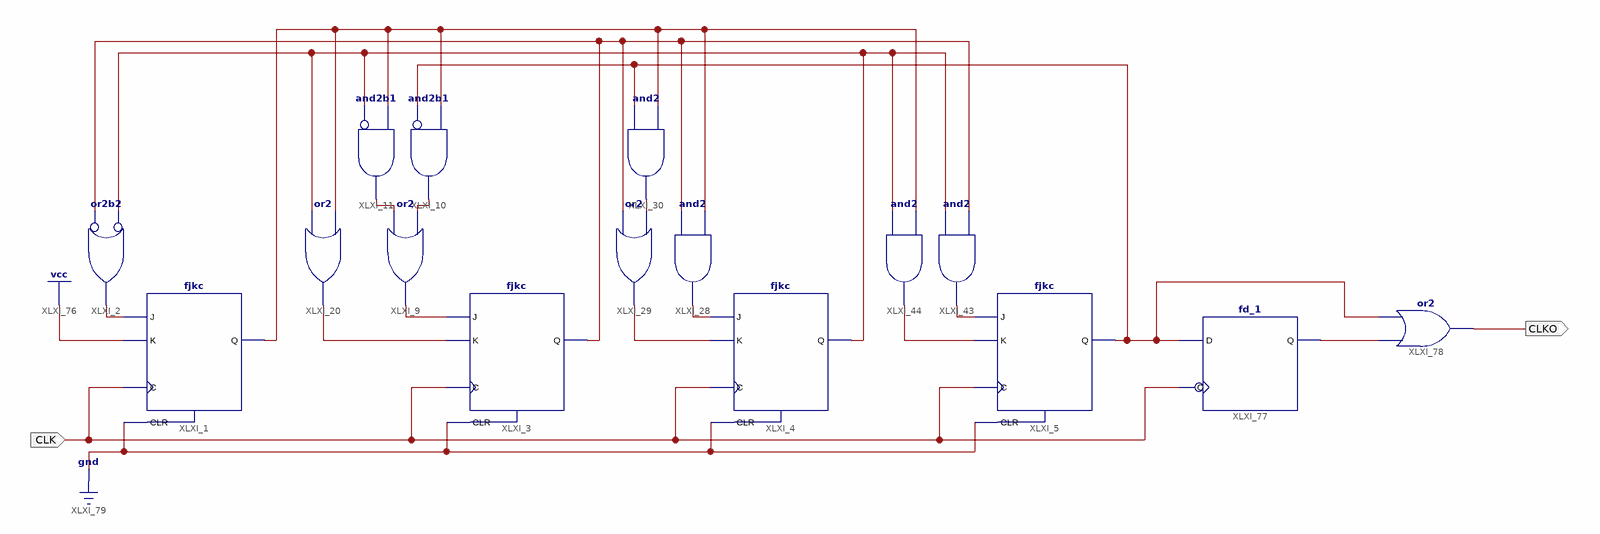
[diagram p0: schematic sheet 1]
// Xilinx ISE schematic clkdiv13.sch (spartan6) as structural Verilog: 16 symbols, 2 ports
module clkdiv13 (
  input  CLK,
  output CLKO
);

  wire XLXN_1, XLXN_2, XLXN_3, XLXN_7, XLXN_12, XLXN_13, XLXN_14, XLXN_21, XLXN_23, XLXN_42, XLXN_43,
       XLXN_44, XLXN_46, XLXN_52, XLXN_53;

  fjkc XLXI_1 (.C(CLK), .CLR(1'b0), .J(XLXN_52), .K(1'b1), .Q(XLXN_42));
  or XLXI_2 (XLXN_52, ~XLXN_43, ~XLXN_44);  // or2b2
  fjkc XLXI_3 (.C(CLK), .CLR(1'b0), .J(XLXN_3), .K(XLXN_7), .Q(XLXN_43));
  and XLXI_10 (XLXN_2, ~XLXN_46, XLXN_42);  // and2b1
  or XLXI_9 (XLXN_3, XLXN_1, XLXN_2);
  and XLXI_11 (XLXN_1, ~XLXN_44, XLXN_42);  // and2b1
  or XLXI_20 (XLXN_7, XLXN_44, XLXN_42);
  fjkc XLXI_4 (.C(CLK), .CLR(1'b0), .J(XLXN_13), .K(XLXN_14), .Q(XLXN_44));
  and XLXI_28 (XLXN_13, XLXN_43, XLXN_42);
  or XLXI_29 (XLXN_14, XLXN_43, XLXN_12);
  and XLXI_30 (XLXN_12, XLXN_46, XLXN_42);
  fjkc XLXI_5 (.C(CLK), .CLR(1'b0), .J(XLXN_21), .K(XLXN_23), .Q(XLXN_46));
  and XLXI_43 (XLXN_21, XLXN_44, XLXN_43);
  and XLXI_44 (XLXN_23, XLXN_44, XLXN_42);
  fd_1 XLXI_77 (.C(CLK), .D(XLXN_46), .Q(XLXN_53));
  or XLXI_78 (CLKO, XLXN_53, XLXN_46);
endmodule
